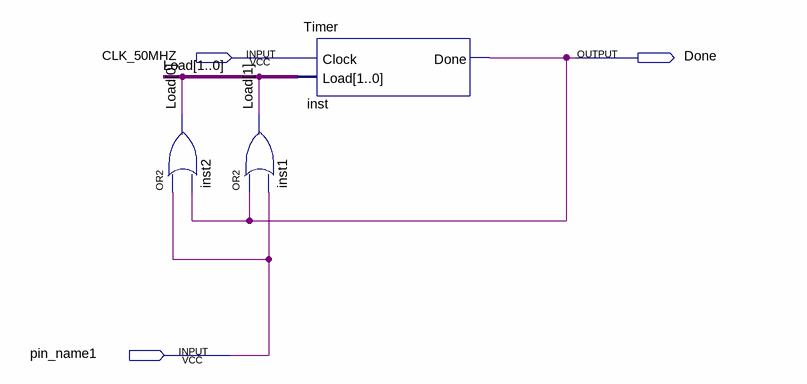
[diagram p0: schematic sheet]
// Quartus schematic loadCounter.bdf as structural Verilog: 3 symbols, 3 pins
module loadCounter (
  input  CLK_50MHZ,
  input  pin_name1,
  output Done
);

  wire [1:0] Load;

  or inst2 (Load[0], pin_name1, Done);
  or inst1 (Load[1], Done, pin_name1);
  Timer inst (.Clock(CLK_50MHZ), .Load(Load), .Done(Done));
endmodule
